# Altium schematic sheet BOC_SRAM.SchDoc: Board-On-Chip Static Ram 128k
size A; Organization: Altium Limited; Address1: L3, 12a Rodborough Rd; Address2: Frenchs Forest; Address3: NSW; Address4: Australia 2086; Revision: 1.06; SheetNumber: 9; SheetTotal: 16
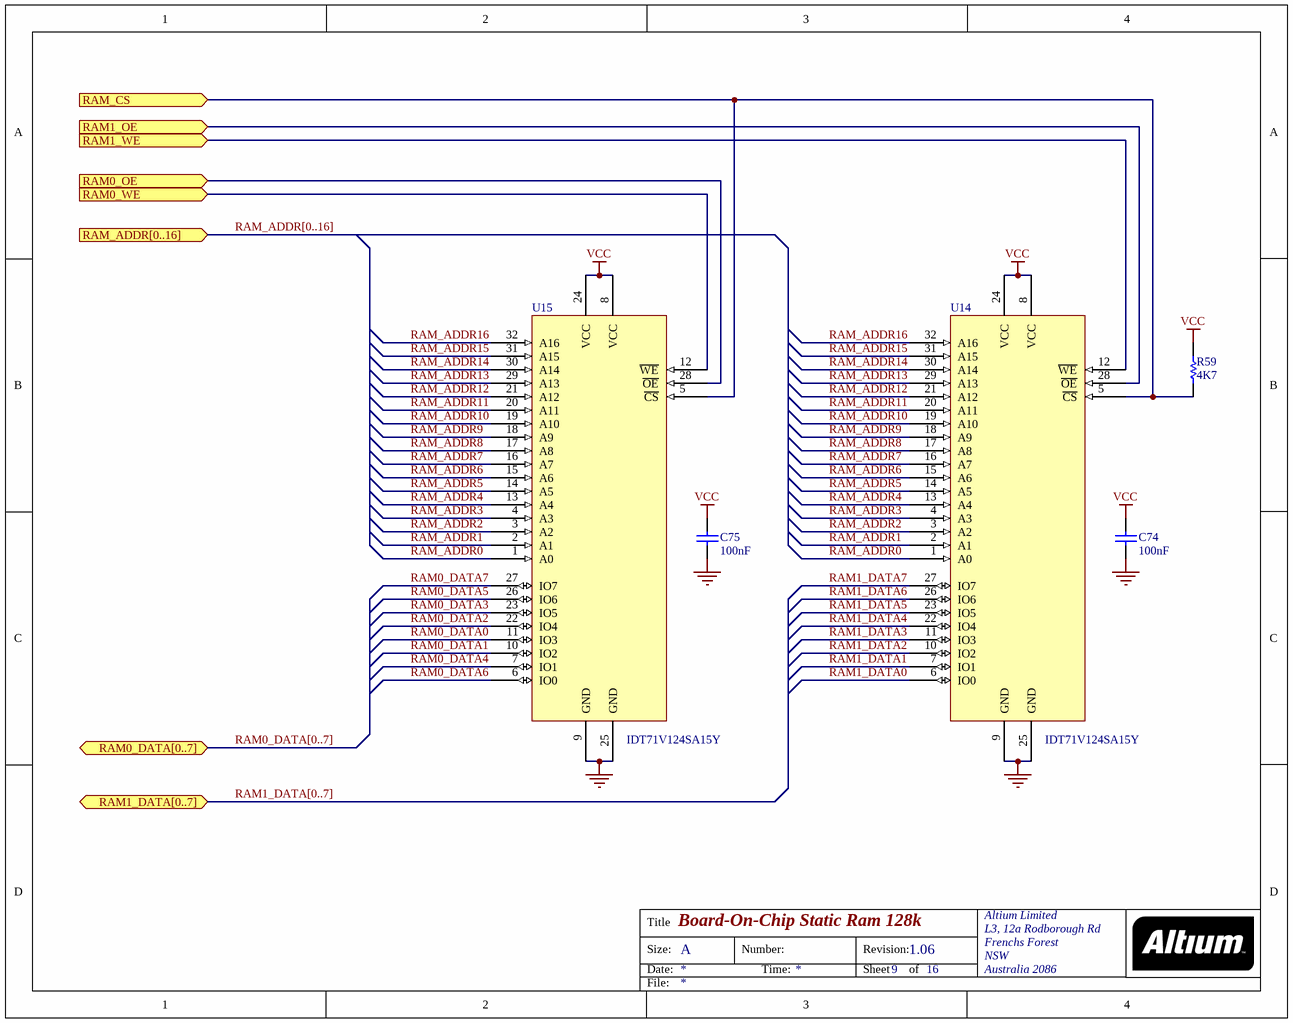
[diagram p0: BOC_SRAM.SchDoc]

## Parts
C74  100nF  [CC2012-0805]
C75  100nF  [CC2012-0805]
R59  4K7  [CC2012-0805]
U14  IDT71V124SA15Y  [SO-J32]
U15  IDT71V124SA15Y  [SO-J32]

## Ports
RAM0_DATA[0..7] (bidir), RAM0_OE (in), RAM0_WE (in), RAM1_DATA[0..7] (bidir), RAM1_OE (in), RAM1_WE (in), RAM_ADDR[0..16] (in), RAM_CS (in)

## Nets
GND: C74.2 C75.2 U14.9(GND) U14.25(GND) U15.9(GND) U15.25(GND)
VCC: C74.1 C75.1 R59.1 U14.8(VCC) U14.24(VCC) U15.8(VCC) U15.24(VCC)
RAM0_DATA0: U15.11(IO3)
RAM0_DATA1: U15.10(IO2)
RAM0_DATA2: U15.22(IO4)
RAM0_DATA3: U15.23(IO5)
RAM0_DATA4: U15.7(IO1)
RAM0_DATA5: U15.26(IO6)
RAM0_DATA6: U15.6(IO0)
RAM0_DATA7: U15.27(IO7)
RAM0_OE: U15.28(~{OE}) ; port RAM0_OE
RAM0_WE: U15.12(~{WE}) ; port RAM0_WE
RAM1_DATA0: U14.6(IO0)
RAM1_DATA1: U14.7(IO1)
RAM1_DATA2: U14.10(IO2)
RAM1_DATA3: U14.11(IO3)
RAM1_DATA4: U14.22(IO4)
RAM1_DATA5: U14.23(IO5)
RAM1_DATA6: U14.26(IO6)
RAM1_DATA7: U14.27(IO7)
RAM1_OE: U14.28(~{OE}) ; port RAM1_OE
RAM1_WE: U14.12(~{WE}) ; port RAM1_WE
RAM_ADDR0: U14.1(A0) U15.1(A0)
RAM_ADDR1: U14.2(A1) U15.2(A1)
RAM_ADDR2: U14.3(A2) U15.3(A2)
RAM_ADDR3: U14.4(A3) U15.4(A3)
RAM_ADDR4: U14.13(A4) U15.13(A4)
RAM_ADDR5: U14.14(A5) U15.14(A5)
RAM_ADDR6: U14.15(A6) U15.15(A6)
RAM_ADDR7: U14.16(A7) U15.16(A7)
RAM_ADDR8: U14.17(A8) U15.17(A8)
RAM_ADDR9: U14.18(A9) U15.18(A9)
RAM_ADDR10: U14.19(A10) U15.19(A10)
RAM_ADDR11: U14.20(A11) U15.20(A11)
RAM_ADDR12: U14.21(A12) U15.21(A12)
RAM_ADDR13: U14.29(A13) U15.29(A13)
RAM_ADDR14: U14.30(A14) U15.30(A14)
RAM_ADDR15: U14.31(A15) U15.31(A15)
RAM_ADDR16: U14.32(A16) U15.32(A16)
RAM_CS: R59.2 U14.5(~{CS}) U15.5(~{CS}) ; port RAM_CS

## Buses and harness runs
bus RAM0_DATA[0..7] = port RAM0_DATA[0..7]
bus RAM1_DATA[0..7] = port RAM1_DATA[0..7]
bus RAM_ADDR[0..16] = port RAM_ADDR[0..16]

## Notes on the sheet
- Title
- Size:
- Date:
- A
- Number:
- Time:
- Revision:
- Sheet
- of
- File:

## Library data of the parts
C74 C75 = CAP: Capacitor; Fitted: True; Supplier: FARNELL; Supplier Code: 317-287
R59 = RES: Resistor; Fitted: True
U14 U15 = IDT71V124SA15Y: 128K x 8 bit Fast Static RAM; Fitted: True; Supplier: IDT